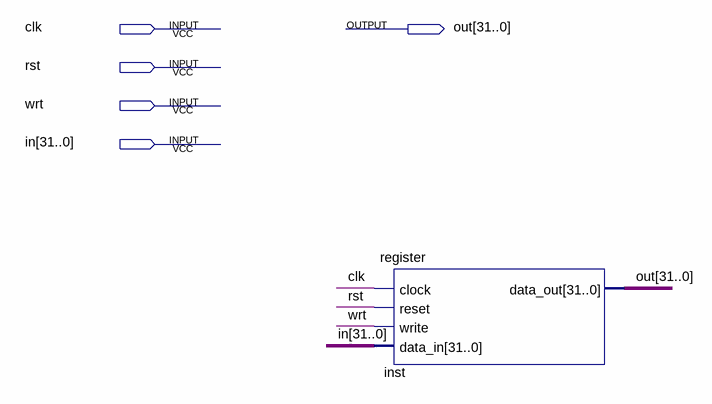
[diagram p0: schematic sheet]
// Quartus schematic simpleregister.bdf as structural Verilog: 1 symbols, 5 pins
module simpleregister (
  input  clk,
  input  rst,
  input  wrt,
  input  [31:0] in,
  output [31:0] out
);

  register inst (.clock(clk), .reset(rst), .write(wrt), .data_in(in), .data_out(out));
endmodule
